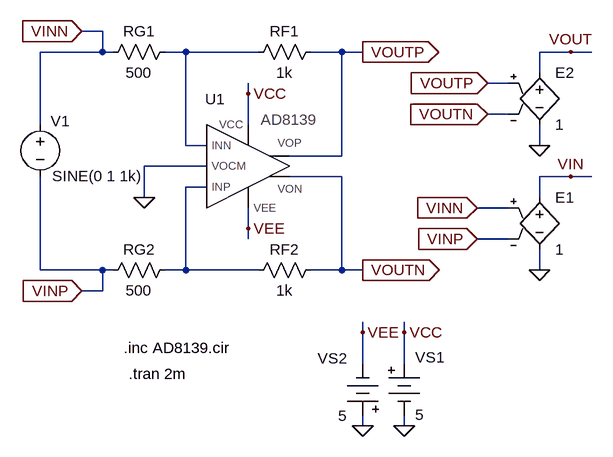
[diagram p0: schematic fig-02-05-14.asc]
fig-02-05-14.asc, the LTspice schematic file:
Version 4
SHEET 1 1332 680
WIRE 32 -160 0 -160
WIRE 32 -128 32 -160
WIRE 32 -128 -64 -128
WIRE 48 -128 32 -128
WIRE 160 -128 128 -128
WIRE 272 -128 160 -128
WIRE 400 -128 352 -128
WIRE 432 -128 400 -128
WIRE 752 -128 704 -128
WIRE 784 -128 752 -128
WIRE 704 -96 704 -128
WIRE 656 -80 624 -80
WIRE 256 -64 256 -80
WIRE 656 -32 624 -32
WIRE -64 -16 -64 -128
WIRE 256 -16 256 -64
WIRE 160 16 160 -128
WIRE 192 16 160 16
WIRE 704 16 704 -16
WIRE 400 32 400 -128
WIRE 400 32 320 32
WIRE 192 48 96 48
WIRE 400 64 320 64
WIRE 752 64 704 64
WIRE 784 64 752 64
WIRE 192 80 160 80
WIRE 96 96 96 48
WIRE 704 96 704 64
WIRE 656 112 608 112
WIRE 256 144 256 112
WIRE 256 160 256 144
WIRE 656 160 608 160
WIRE -64 208 -64 64
WIRE 32 208 -64 208
WIRE 48 208 32 208
WIRE 160 208 160 80
WIRE 160 208 128 208
WIRE 272 208 160 208
WIRE 400 208 400 64
WIRE 400 208 352 208
WIRE 432 208 400 208
WIRE 704 208 704 176
WIRE 32 240 32 208
WIRE 32 240 0 240
WIRE 432 304 432 288
WIRE 496 304 496 288
WIRE 432 352 432 304
WIRE 496 352 496 304
WIRE 432 448 432 432
WIRE 496 448 496 432
FLAG 432 -128 VOUTP
IOPIN 432 -128 Out
FLAG 96 96 0
FLAG 432 448 0
FLAG 496 448 0
FLAG 432 304 VEE
FLAG 496 304 VCC
FLAG 256 -64 VCC
FLAG 256 144 VEE
FLAG 432 208 VOUTN
IOPIN 432 208 Out
FLAG 0 -160 VINN
IOPIN 0 -160 In
FLAG 0 240 VINP
IOPIN 0 240 In
FLAG 704 16 0
FLAG 704 208 0
FLAG 608 160 VINP
IOPIN 608 160 In
FLAG 608 112 VINN
IOPIN 608 112 In
FLAG 624 -32 VOUTN
IOPIN 624 -32 In
FLAG 624 -80 VOUTP
IOPIN 624 -80 In
FLAG 752 64 VIN
FLAG 752 -128 VOUT
SYMBOL res 368 -144 R90
WINDOW 0 0 56 VBottom 2
WINDOW 3 32 56 VTop 2
SYMATTR InstName RF1
SYMATTR Value 1k
SYMBOL res 144 -144 R90
WINDOW 0 0 56 VBottom 2
WINDOW 3 32 56 VTop 2
SYMATTR InstName RG1
SYMATTR Value 500
SYMBOL voltage -64 -32 R0
WINDOW 0 31 26 Bottom 2
WINDOW 3 87 111 Bottom 2
WINDOW 123 35 89 Top 2
WINDOW 39 0 0 Left 0
SYMATTR InstName V1
SYMATTR Value SINE(0 1 1k)
SYMBOL Misc\\battery 496 336 R0
WINDOW 0 17 6 Left 2
WINDOW 3 17 95 Left 2
WINDOW 123 0 0 Left 0
WINDOW 39 0 0 Left 0
SYMATTR InstName VS1
SYMATTR Value 5
SYMBOL Misc\\battery 432 448 R180
WINDOW 0 24 104 Left 2
WINDOW 3 24 16 Left 2
WINDOW 123 0 0 Left 0
WINDOW 39 0 0 Left 0
SYMATTR InstName VS2
SYMATTR Value 5
SYMBOL AD8139-sub 256 48 R0
WINDOW 0 -51 -88 Bottom 2
SYMATTR InstName U1
SYMATTR Value AD8139
SYMATTR Prefix X
SYMBOL res 368 192 R90
WINDOW 0 0 56 VBottom 2
WINDOW 3 32 56 VTop 2
SYMATTR InstName RF2
SYMATTR Value 1k
SYMBOL res 144 192 R90
WINDOW 0 0 56 VBottom 2
WINDOW 3 32 56 VTop 2
SYMATTR InstName RG2
SYMATTR Value 500
SYMBOL e 704 80 R0
SYMATTR InstName E1
SYMATTR Value 1
SYMBOL e 704 -112 R0
SYMATTR InstName E2
SYMATTR Value 1
TEXT 64 328 Left 2 !.inc AD8139.cir
TEXT 72 368 Left 2 !.tran 2m

The netlist it stands for:
* fig-02-05-14.asc
RF1 VOUTP N001 1k
RG1 N001 VINN 500
V1 VINN VINP SINE(0 1 1k)
VS1 VCC 0 5
VS2 0 VEE 5
XU1 N001 0 VCC VOUTP VOUTN VEE N002 AD8139-sub params: AD8139  ; pins INN VOCM VCC VOP VON VEE INP
RF2 VOUTN N002 1k
RG2 N002 VINP 500
E1 VIN 0 VINN VINP 1
E2 VOUT 0 VOUTP VOUTN 1
.inc AD8139.cir
.tran 2m
.backanno
.end